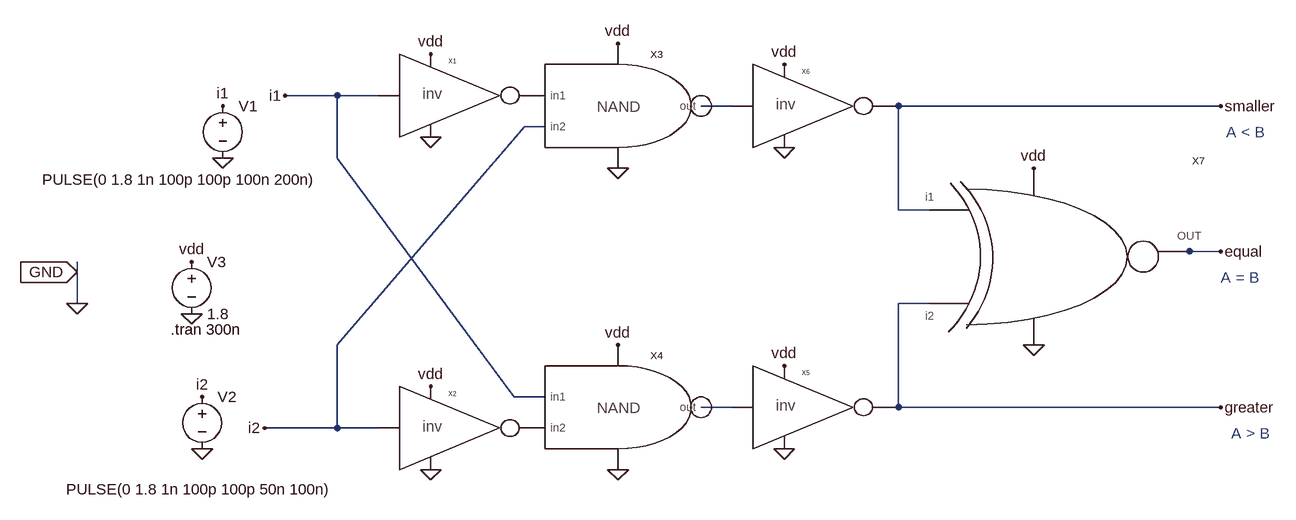
[diagram p0: schematic comparator1bit.asc]
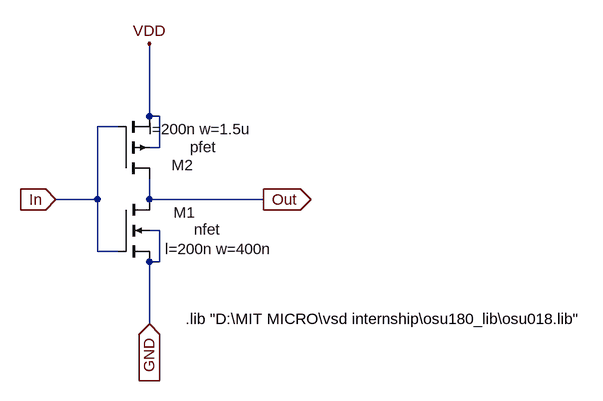
[diagram p1: sub-circuit inv_20_10.asc]
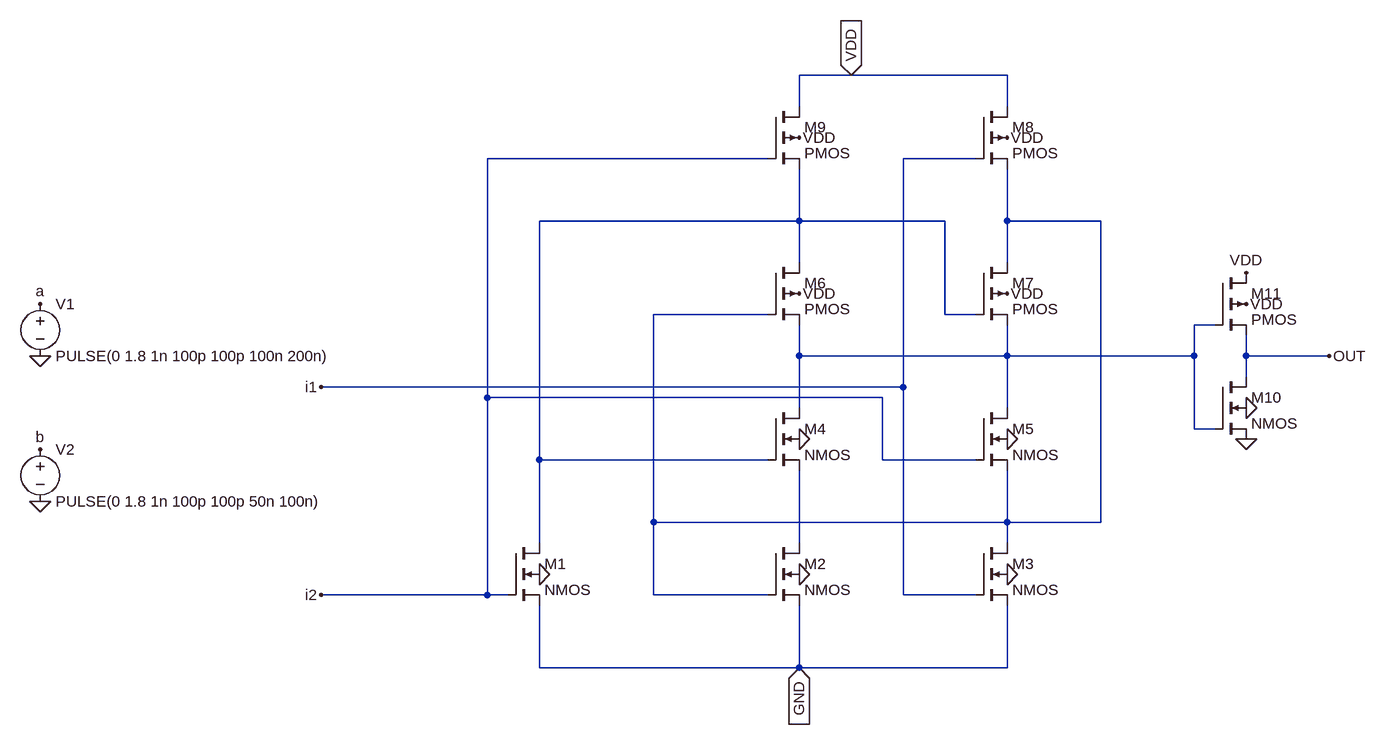
[diagram p2: sub-circuit exnor.asc]
comparator1bit.asc, the LTspice schematic file:
Version 4
SHEET 1 1764 964
WIRE -64 96 -144 96
WIRE 0 96 -64 96
WIRE 544 112 496 112
WIRE 1296 112 800 112
WIRE 256 144 224 144
WIRE -64 192 -64 96
WIRE 800 272 800 112
WIRE 848 272 800 272
WIRE 1248 336 1200 336
WIRE 1296 336 1248 336
WIRE -464 368 -464 352
WIRE -464 416 -464 368
WIRE 848 416 800 416
WIRE -64 480 224 144
WIRE 208 560 -64 192
WIRE 256 560 208 560
WIRE 544 576 496 576
WIRE 800 576 800 416
WIRE 1296 576 800 576
WIRE -64 608 -64 480
WIRE -64 608 -176 608
WIRE 0 608 -64 608
FLAG -240 192 0
FLAG -272 640 0
FLAG -288 432 0
FLAG -144 96 i1
FLAG -240 112 i1
FLAG -272 560 i2
FLAG -288 352 vdd
FLAG -176 608 i2
FLAG 1296 112 smaller
FLAG 1296 336 equal
FLAG 1296 576 greater
FLAG -464 416 0
FLAG -464 368 GND
IOPIN -464 368 In
FLAG 80 32 vdd
FLAG 80 544 vdd
FLAG 368 480 vdd
FLAG 368 16 vdd
FLAG 624 48 vdd
FLAG 624 512 vdd
FLAG 1008 208 vdd
FLAG 1008 480 0
FLAG 624 640 0
FLAG 368 672 0
FLAG 624 176 0
FLAG 368 208 0
FLAG 80 672 0
FLAG 80 160 0
SYMBOL INV_20_10 32 32 R0
SYMATTR InstName X1
SYMBOL INV_20_10 32 544 R0
SYMATTR InstName X2
SYMBOL nand101 336 112 R0
SYMATTR InstName X3
SYMBOL nand101 336 576 R0
SYMATTR InstName X4
SYMBOL INV_20_10 576 512 R0
SYMATTR InstName X5
SYMBOL INV_20_10 576 48 R0
SYMATTR InstName X6
SYMBOL voltage -240 96 R0
WINDOW 3 -278 129 Left 2
SYMATTR Value PULSE(0 1.8 1n 100p 100p 100n 200n)
SYMATTR InstName V1
SYMBOL voltage -272 544 R0
WINDOW 3 -209 158 Left 2
SYMATTR Value PULSE(0 1.8 1n 100p 100p 50n 100n)
SYMATTR InstName V2
SYMBOL voltage -288 336 R0
WINDOW 123 0 0 Left 0
WINDOW 39 0 0 Left 0
SYMATTR InstName V3
SYMATTR Value 1.8
SYMBOL exNor 944 336 R0
SYMATTR InstName X7
TEXT 1304 152 Left 2 ;A < B
TEXT 1296 376 Left 2 ;A = B
TEXT 1312 616 Left 2 ;A > B
TEXT -320 456 Left 2 !.tran 300n

inv_20_10.asc, the sub-circuit schematic file:
Version 4
SHEET 1 1196 680
WIRE 448 -304 448 -416
WIRE 464 -304 448 -304
WIRE 400 -288 368 -288
WIRE 464 -256 464 -304
WIRE 464 -256 448 -256
WIRE 368 -176 368 -288
WIRE 368 -176 304 -176
WIRE 448 -176 448 -208
WIRE 624 -176 448 -176
WIRE 464 -128 448 -128
WIRE 368 -96 368 -176
WIRE 400 -96 368 -96
WIRE 464 -80 464 -128
WIRE 464 -80 448 -80
WIRE 448 16 448 -80
FLAG 304 -176 In
IOPIN 304 -176 In
FLAG 624 -176 Out
IOPIN 624 -176 Out
FLAG 448 -416 VDD
FLAG 448 16 GND
IOPIN 448 16 In
SYMBOL nmos4 400 -176 R0
WINDOW 0 119 20 Right 2
WINDOW 3 157 46 Right 2
WINDOW 123 238 76 Right 2
SYMATTR InstName M1
SYMATTR Value nfet
SYMATTR Value2 l=200n w=400n
SYMBOL pmos4 400 -208 M180
WINDOW 0 116 21 Right 2
WINDOW 3 151 49 Right 2
WINDOW 123 206 76 Right 2
SYMATTR InstName M2
SYMATTR Value pfet
SYMATTR Value2 l=200n w=1.5u
TEXT 504 8 Left 2 !.lib "D:\\MIT MICRO\\vsd internship\\osu180_lib\\osu018.lib"

exnor.asc, the sub-circuit schematic file:
Version 4
SHEET 1 1412 680
WIRE 528 -624 448 -624
WIRE 768 -624 528 -624
WIRE 448 -576 448 -624
WIRE 768 -576 768 -624
WIRE 400 -496 -32 -496
WIRE 720 -496 608 -496
WIRE 448 -400 448 -480
WIRE 448 -400 48 -400
WIRE 672 -400 448 -400
WIRE 768 -400 768 -480
WIRE 912 -400 768 -400
WIRE 448 -336 448 -400
WIRE 768 -336 768 -400
WIRE 400 -256 224 -256
WIRE 672 -256 672 -400
WIRE 720 -256 672 -256
WIRE 1088 -240 1056 -240
WIRE 448 -192 448 -240
WIRE 768 -192 768 -240
WIRE 768 -192 448 -192
WIRE 1056 -192 1056 -240
WIRE 1056 -192 768 -192
WIRE 1136 -192 1136 -224
WIRE 1264 -192 1136 -192
WIRE 1136 -160 1136 -192
WIRE 608 -144 608 -496
WIRE 608 -144 -288 -144
WIRE -32 -128 -32 -496
WIRE 576 -128 -32 -128
WIRE 448 -112 448 -192
WIRE 768 -112 768 -192
WIRE 1056 -80 1056 -192
WIRE 1088 -80 1056 -80
WIRE 48 -32 48 -400
WIRE 400 -32 48 -32
WIRE 576 -32 576 -128
WIRE 720 -32 576 -32
WIRE 224 64 224 -256
WIRE 768 64 768 -16
WIRE 768 64 224 64
WIRE 912 64 912 -400
WIRE 912 64 768 64
WIRE 48 96 48 -32
WIRE 448 96 448 -16
WIRE 768 96 768 64
WIRE -32 176 -32 -128
WIRE -32 176 -288 176
WIRE 0 176 -32 176
WIRE 224 176 224 64
WIRE 400 176 224 176
WIRE 608 176 608 -144
WIRE 720 176 608 176
WIRE 48 288 48 192
WIRE 448 288 448 192
WIRE 448 288 48 288
WIRE 768 288 768 192
WIRE 768 288 448 288
FLAG -720 -272 a
FLAG -720 -48 b
FLAG -288 -144 i1
FLAG -288 176 i2
FLAG -720 -192 0
FLAG -720 32 0
FLAG 48 144 0
FLAG 448 144 0
FLAG 768 144 0
FLAG 768 -64 0
FLAG 448 -64 0
FLAG 448 -288 VDD
FLAG 448 -528 VDD
FLAG 768 -528 VDD
FLAG 768 -288 VDD
FLAG 1136 -112 0
FLAG 1136 -64 0
FLAG 1136 -320 VDD
FLAG 1136 -272 VDD
FLAG 1264 -192 OUT
FLAG 448 288 GND
IOPIN 448 288 In
FLAG 528 -624 VDD
IOPIN 528 -624 In
SYMBOL voltage -720 -288 R0
SYMATTR InstName V1
SYMATTR Value PULSE(0 1.8 1n 100p 100p 100n 200n)
SYMBOL voltage -720 -64 R0
WINDOW 123 0 0 Left 0
WINDOW 39 0 0 Left 0
SYMATTR InstName V2
SYMATTR Value PULSE(0 1.8 1n 100p 100p 50n 100n)
SYMBOL nmos4 0 96 R0
SYMATTR InstName M1
SYMBOL nmos4 400 96 R0
SYMATTR InstName M2
SYMBOL nmos4 720 96 R0
SYMATTR InstName M3
SYMBOL nmos4 400 -112 R0
SYMATTR InstName M4
SYMBOL nmos4 720 -112 R0
SYMATTR InstName M5
SYMBOL pmos4 400 -336 R0
SYMATTR InstName M6
SYMBOL pmos4 720 -336 R0
SYMATTR InstName M7
SYMBOL pmos4 720 -576 R0
SYMATTR InstName M8
SYMBOL pmos4 400 -576 R0
SYMATTR InstName M9
SYMBOL nmos4 1088 -160 R0
SYMATTR InstName M10
SYMBOL pmos4 1088 -320 R0
SYMATTR InstName M11

The netlist it stands for:
* comparator1bit.asc
XX1 i1 P001 vdd 0 inv_20_10
XX2 i2 P002 vdd 0 inv_20_10
XX3 P001 i2 N001 vdd 0 nand101  ; pins in1 in2 out VDD GND
XX4 i1 P002 N002 vdd 0 nand101  ; pins in1 in2 out VDD GND
XX5 N002 greater vdd 0 inv_20_10
XX6 N001 smaller vdd 0 inv_20_10
V1 i1 0 PULSE(0 1.8 1n 100p 100p 100n 200n)
V2 i2 0 PULSE(0 1.8 1n 100p 100p 50n 100n)
V3 vdd 0 1.8
XX7 smaller greater equal vdd 0 exnor

* block symbol definitions
.subckt inv_20_10 In Out VDD GND
M1 Out In GND GND nfet l=200n w=400n
M2 Out In VDD VDD pfet l=200n w=1.5u
.lib "D:\MIT MICRO\vsd internship\osu180_lib\osu018.lib"
.ends inv_20_10

.subckt exnor i1 i2 OUT VDD GND
V1 a 0 PULSE(0 1.8 1n 100p 100p 100n 200n)
V2 b 0 PULSE(0 1.8 1n 100p 100p 50n 100n)
M1 N001 i2 GND 0 NMOS
M2 N004 N002 GND 0 NMOS
M3 N002 i1 GND 0 NMOS
M4 N003 N001 N004 0 NMOS
M5 N003 i2 N002 0 NMOS
M6 N001 N002 N003 VDD PMOS
M7 N002 N001 N003 VDD PMOS
M8 VDD i1 N002 VDD PMOS
M9 VDD i2 N001 VDD PMOS
M10 OUT N003 0 0 NMOS
M11 VDD N003 OUT VDD PMOS
.ends exnor

.model NMOS NMOS
.model PMOS PMOS
.lib standard.mos
* A < B
* A = B
* A > B
.tran 300n
.backanno
.end

* Results of the author's LTspice run, read from the files saved beside the schematic
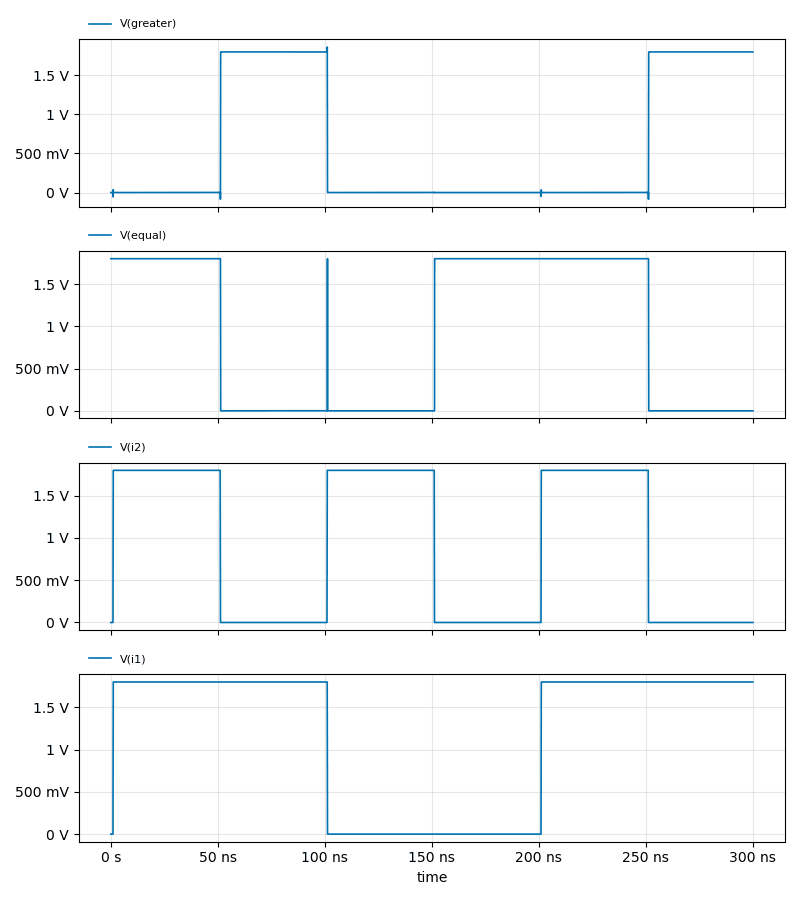
[diagram p3: Transient Analysis of comparator1bit.asc, plotted from the saved traces]
* Transient Analysis, 1 run:
*   V(greater): min -85.18 mV, max 1.862 V, average 592.1 mV, rms 1.032 V, last 1.8 V
*   V(equal): min 0 V, max 1.8 V, average 907.8 mV, rms 1.278 V, last 0 V
*   V(i2): min 0 V, max 1.8 V, average 901.8 mV, rms 1.274 V, last 0 V
*   V(i1): min 0 V, max 1.8 V, average 1.194 V, rms 1.466 V, last 1.8 V